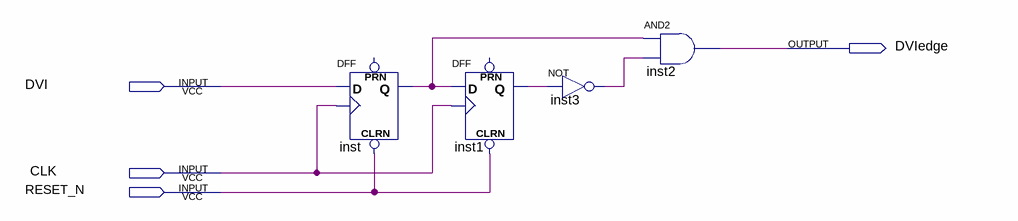
[diagram p0: schematic sheet]
// Quartus schematic edgeDetector.bdf as structural Verilog: 4 symbols, 4 pins
module edgeDetector (
  input  DVI,
  input  CLK,
  input  RESET_N,
  output DVIedge
);

  wire inst1_q, inst3_out, inst_q;

  DFF inst (.CLRN(RESET_N), .CLK(CLK), .D(DVI), .Q(inst_q));  // open: PRN
  DFF inst1 (.CLRN(RESET_N), .CLK(CLK), .D(inst_q), .Q(inst1_q));  // open: PRN
  not inst3 (inst3_out, inst1_q);
  and inst2 (DVIedge, inst_q, inst3_out);
endmodule
